# Altium schematic sheet power.SchDoc: Power
size A3; SheetNumber: 3
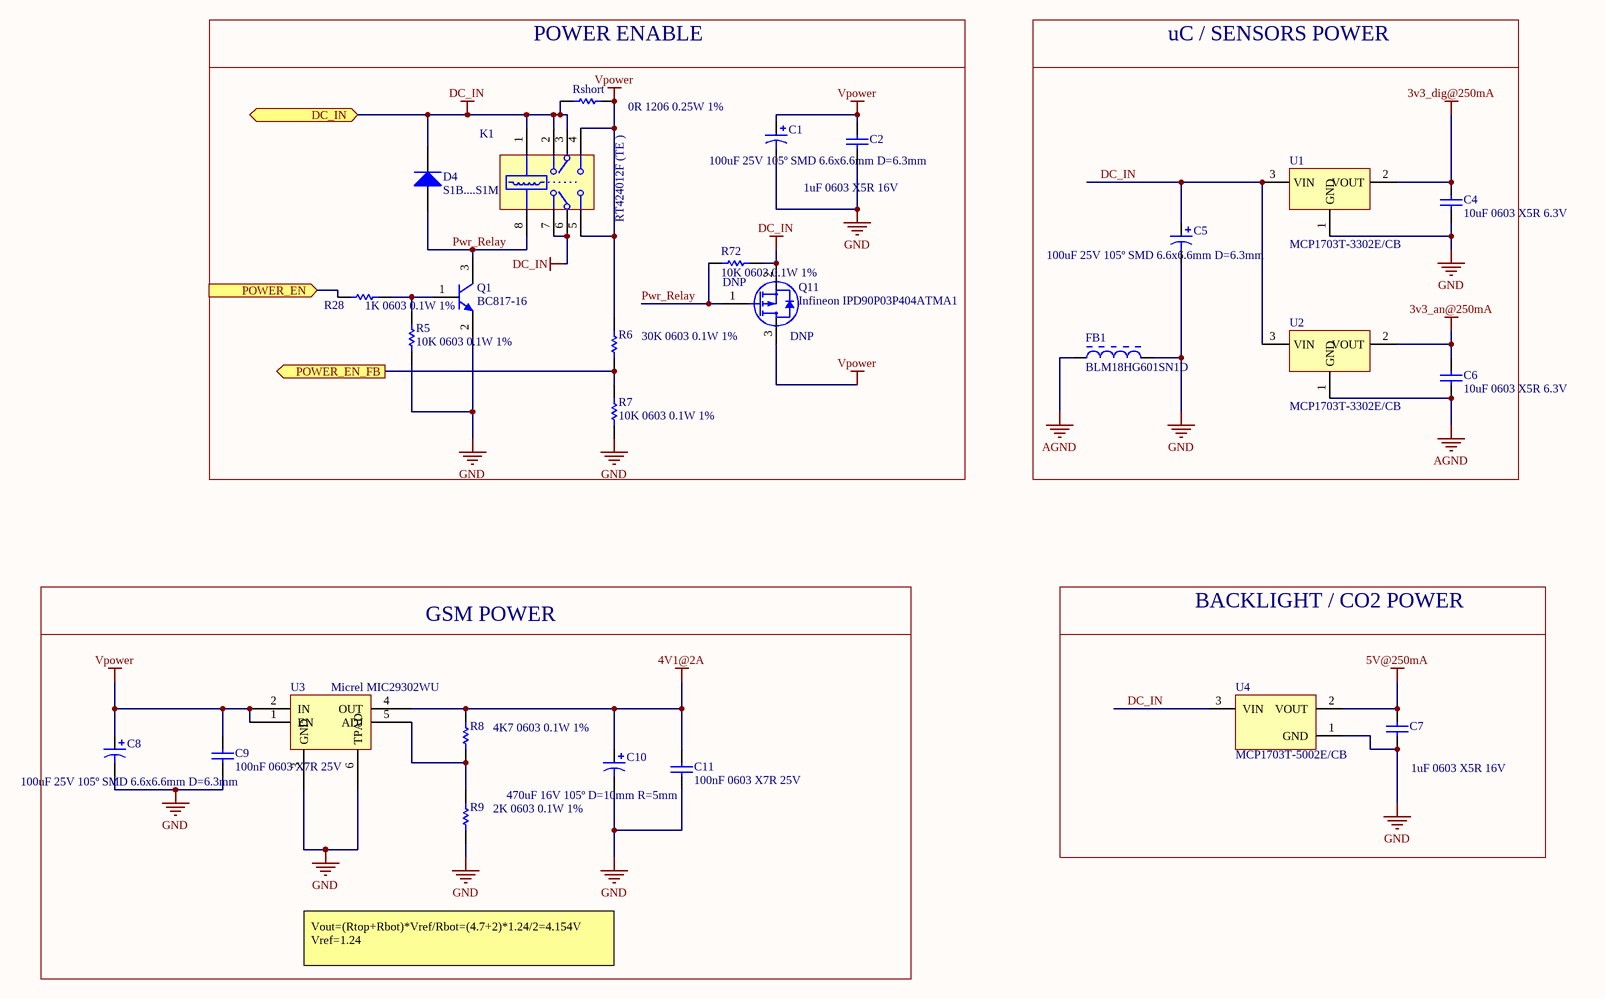
[diagram p0: power.SchDoc]

## Parts
C1  100uF 25V 105º SMD 6.6x6.6mm D=6.3mm  [PCB-5eg0a5nygcrzw5ibm1j9-1]
C2  1uF 0603 X5R 16V  [CAPC1608X60X35NL10T15]
C4  10uF 0603 X5R 6.3V  [CAPC1608X60X35NL10T15]
C5  100uF 25V 105º SMD 6.6x6.6mm D=6.3mm  [PCB-5eg0a5nygcrzw5ibm1j9-1]
C6  10uF 0603 X5R 6.3V  [CAPC1608X60X35NL10T15]
C7  1uF 0603 X5R 16V  [CAPC1608X60X35NL10T15]
C8  100uF 25V 105º SMD 6.6x6.6mm D=6.3mm  [PCB-5eg0a5nygcrzw5ibm1j9-1]
C9  100nF 0603 X7R 25V  [CAPC1608X60X35NL10T15]
C10  470uF 16V 105º D=10mm R=5mm  [PCBComponent_1 - duplicate]
C11  100nF 0603 X7R 25V  [CAPC1608X60X35NL10T15]
D4  S1B....S1M (DO-214)  [PCB-niliznqw36k7etm1u9na-1]
FB1  BLM18HG601SN1D  [MURA-BLM18-F-H1-CHIP-2_V]
K1  Manufacturer Part Number: RT424012F (TE )  [PCB-gjrzw9dtiyu3qrueb5gw-1]  (hidden comment: SYM-d1a918a3c97c0e6e-1)
Q1  BC817-16  [PCB-856332-1]
Q11  Infineon IPD90P03P404ATMA1  [DPAK IPD90P03P404ATMA1]  (no BOM)
R5  10K 0603 0.1W 1%  [RESC1609X55X30ML10T20]
R6  30K 0603 0.1W 1%  [RESC1609X55X30ML10T20]
R7  10K 0603 0.1W 1%  [RESC1609X55X30ML10T20]
R8  4K7 0603 0.1W 1%  [RESC1609X55X30ML10T20]
R9  2K 0603 0.1W 1%  [RESC1609X55X30ML10T20]
R28  1K 0603 0.1W 1%  [RESC1609X55X30ML10T20]
R72  10K 0603 0.1W 1%  [RESC1609X55X30ML10T20]
Rshort  0R 1206 0.25W 1%  [PCB-sxvxwfnl72ysl1kmtzgv-1]  (no BOM)
U1  MCP1703T-3302E/CB  [SOT-23A-CB3_L]
U2  MCP1703T-3302E/CB  [SOT-23A-CB3_L]
U3  Micrel MIC29302WU  [TI-KTT5_N]
U4  MCP1703T-5002E/CB  [SOT-23A-CB3_L]

## Blocks framed on the sheet
POWER ENABLE: C1 C2 D4 K1 Q1 Q11 R5-R7 R28 R72 Rshort
uC / SENSORS POWER: C4-C6 FB1 U1 U2
BACKLIGHT / CO2 POWER: C7 U4
GSM POWER: C8-C11 R8 R9 U3

## Ports
DC_IN, POWER_EN (in), POWER_EN_FB (out)

## Nets
3v3_an@250mA: C6.2 U2.2(VOUT)
3v3_dig@250mA: C4.2 U1.2(VOUT)
4V1@2A: C10.1 C11.2 R8.2 U3.4(OUT)
5V@250mA: C7.1 U4.2(VOUT)
AGND: C6.1 FB1.1 U2.1(GND)
DC_IN: C5.1 D4.2(K) K1.1 K1.2 K1.3 K1.6 K1.7 Q11.2(S) R72.2 Rshort.1 U1.3(VIN) U2.3(VIN) U4.3(VIN) ; port DC_IN
GND: C1.2 C2.2 C4.1 C5.2 C7.2 C8.2 C9.1 C10.2 C11.1 FB1.2 Q1.2(E) R5.2 R7.2 R9.1 U1.1(GND) U3.3(GND) U3.6(TPAD) U4.1(GND)
Vpower: C1.1 C2.1 C8.1 C9.2 K1.4 K1.5 Q11.3(D) R6.2 Rshort.2 U3.1(EN) U3.2(IN)
POWER_EN: R28.1 ; port POWER_EN
POWER_EN_FB: R6.1 R7.1 ; port POWER_EN_FB
Pwr_Relay: D4.1(A) K1.8 Q1.3(C) Q11.1(G) R72.1
NetQ1_1: Q1.1(B) R5.1 R28.2
NetR8_1: R8.1 R9.2 U3.5(ADJ)

## Notes on the sheet
- Vout=(Rtop+Rbot)*Vref/Rbot=(4.7+2)*1.24/2=4.154V
  Vref=1.24
- Title
- Size:
- Date:
- A3
- Author:
- Time:
- Revision:
- Sheet
- of
- File:

## Library data of the parts
C1 C5 C8 = CMP-a6d16ad512617916-1: Manufacturer Part Number: VZL101M1ETR-0607; Tolerance: 20%; Octopart URL: https://octopart.com/vzl101m1etr-0607-lelon-84840918; OctopartID: a6d16ad512617916; Capacity: 100uF; Voltage rating: 25V
C2 C7 = CMP-119984-2: Manufacturer Part Number: GRM185R61C105KE44D; Capacitance Tolerance: ±10%; Case/Package (in): 0603; Lead-Free Status: Lead Free; Capacitance: 1uF; Dielectric Characteristic: X5R; Lifecycle Status: Active; Mounting Style: Surface Mount; Number of Pins: 2; Octopart Url: https://octopart.com/grm185r61c105ke44d-murata-197446; OctopartID: de3e1737f81e01f9; REACH SVHC Compliance: No SVHC; RoHS: Compliant; Size-Height: 0.0005 m; Size-Length: 0.0016 m; Size-Thickness: 0.0005 m; Size-Width: 0.0008 m; Rated voltage: 16V
C4 C6 = CMP-121364-8: Rated voltage: 6v3; Dielectric carachteristic: X5R; Capacitance: 10uF; package: 0603
C9 C11 = CMP-c41a0d2b65641bdd-3: package: 0603; capacitance: 100 nF; Dielectric Characteristic: X7R; Rated voltage: 25V
C10 = CMP-ebd022d405293417-3: Manufacturer Part Number: 477CKH016M; Dielectric Material: Aluminum Electrolytic; Equivalent Series Resistance (ESR): 600 m?; Voltage Rating (DC): 16.0 V; Capacitance Tolerance: ±20%; Capacitance: 470 µF; Lead-Free Status: Lead Free; Size-Height: 12.5 mm; Mounting Style: Through Hole; OctopartID: ebd022d405293417; Octopart URL: https://octopart.com/477ckh016m-illinois+capacitor-969631; Size-Diameter: 10.0 mm; RoHS: Compliant; Packaging: Bulk
D4 = CMP-50d799d860158f10-1: Manufacturer Part Number: S1BB-13-F; Output Current: 1.00 A (max); Lead-Free Status: Exempt; Current Rating: 1.00 A; Polarity: Standard; Capacitance: 10.0 pF; Case/Package: DO-214; Lifecycle Status: Not Listed by Manufacturer; Octopart URL: https://octopart.com/s1bb-13-f-diodes+inc.-333220; RoHS: Compliant; Mounting Style: Surface Mount; OctopartID: 50d799d860158f10; Packaging: Cut Tape (CT), Tape & Reel (TR)
FB1 = CMP-19299602-3: Current Rating: 0.2 A; Frequency: 100000000.0 Hz; Lead-Free Status: Lead Free; Number of Circuits: 1; Resistance: 600.0 Ω; Shielding: No; Value: 600ohm 200mA; Manufacturer Part Number: BLM18HG601SN1D; Case/Package: 0603; Mounting Style: Surface Mount; Number of Pins: 2; Octopart Url: https://octopart.com/blm18hg601sn1d-murata-368340; OctopartID: c121082e7a931ee6; REACH SVHC Compliance: No SVHC; RoHS: Compliant; Size-Height: 0.0008 m; Size-Length: 0.0016 m; Size-Width: 0.0008 m
K1 = CMP-48a583f3a11c9762-9: Relay; E-Mech; Gen Purp; DPDT; Cur-Rtg 8A; Ctrl-V 12DC; Vol-Rtg 277/30AC/DC; PCB Mnt; ELV Compliant: Compliant; Voltage Rating (DC): 12.0 V; Coil Voltage: 12.0 V, 12.0 V (max); Coil Current: 33.3 mA; Current Rating: 8.00 A; Dropout Voltage: 1.20 V; Coil Resistance: 360 Ω; Lead-Free Status: Lead Free; Coil Power (DC): 400 mW; Mounting Style: PCB; REACH SVHC Compliance: No SVHC; Size-Length: 29.0 mm; Lifecycle Status: Active; Carry Current: 8.00 A; Contact Current Rating: 8.00 A; Size-Width: 12.7 mm; Octopart URL: http://octopart.com/rt424012f-te+connectivity-39636191; Contacts Type: DPDT; Input Voltage (DC): 12.0 V; Case/Package: DIP; RoHS: Compliant; OctopartID: 48a583f3a11c9762; Packaging: Box, Tube; Size-Height: 15.7 mm
Q1 = CMP-856332-3: TRANS NPN 45V 500mA SMD SOT23-3; Current Rating: 0.6 A; Lead-Free Status: Lead Free; Power Dissipation: 0.3 W; Voltage Rating (DC): 40.0 V; Case/Package: SOT-23; Lifecycle Status: Active; Mounting Style: Surface Mount; Number of Pins: 3; Octopart Url: https://octopart.com/mmbt2222a-7-f-diodes+inc.-357838; OctopartID: 53a79aa8030f8c60; Packaging: Cut Tape (CT); Polarity: NPN; REACH SVHC Compliance: No SVHC; RoHS: Compliant
Q11 = CMP-3103264-4: Single P-Channel 30 V 4.5 mOhm 100 nC OptiMOS Power Mosfet - TO-252-3-11; Lead-Free Status: Lead Free; Packaging: Reel; Operating Temperature: 175 °C (max); RoHS: Compliant; Polarity: P-Channel; Octopart URL: https://octopart.com/ipd90p03p404atma1-infineon-21386769; Mounting Style: Surface Mount; Manufacturer Part Number: IPD90P03P404ATMA1; OctopartID: f6ad3ee185da296a; Number of Pins: 3; REACH SVHC Compliance: No SVHC; DNP: DNP
R5 R7 R72 = CMP-4716590-9: Octopart Url: https://octopart.com/crcw060310k0fkeahp-vishay-42634028; package: 0603; Resistance: 10k; Tolerance: 1%
  R72: DNP: DNP
R6 R8 R9 = CMP-3655986-6: Tolerance: 1%; package: 0603
  R6: Resistance: 30k
  R8: Resistance: 4K7
  R9: Resistance: 2K
R28 = CMP-a61f6f36030f79d8-4: Manufacturer Part Number: CR0603-FX-1001ELF; Power Rating: 100 mW; Case/Package (SI): 1608; Voltage Rating (DC): 50.0 V; Temperature Coefficient: -100 ppm/°C to 100 ppm/°C; REACH SVHC Compliance: No SVHC; Packaging: Tape & Reel (TR), Cut Tape (CT); Resistance Tolerance: ±1%; Resistance: 1k; RoHS: Compliant; Mounting Style: Surface Mount; Number of Pins: 2; Size-Length: 1.60 mm; Octopart URL: https://octopart.com/cr0603-fx-1001elf-bourns-2326646; Size-Thickness: 457 µm; OctopartID: a61f6f36030f79d8; Size-Width: 787 µm; Case/Package: 0603
Rshort = CMP-3f1bf473a47ce0dc-5: Manufacturer Part Number: RC1206JR-070RL; Lead-Free Status: Lead Free; Resistance Tolerance: ±5%; Voltage Rating (DC): 200 V; Power Rating: 250 mW; Case/Package (SI): 3216; Resistance: 0R; Packaging: Cut Tape (CT), Tape & Reel (TR); Size-Width: 1.60 mm; Case/Package: 1206; Mounting Style: Surface Mount; Size-Length: 3.10 mm; OctopartID: 3f1bf473a47ce0dc; Number of Pins: 2; RoHS: Compliant
U1 U2 = CMP-1493313-4: Lead-Free Status: Lead Free; Number of Outputs: 1; Output Capacitor Type: Ceramic; Quiescent Current: 2e-06 A; Dropout Voltage: 0.65 V; RoHS: Compliant; Mounting Style: Surface Mount; OctopartID: 3caef5ca6a72e369; Packaging: Cut Tape (CT); Octopart Url: https://octopart.com/mcp1703t-3302e%2Fcb-microchip-7238586; Lifecycle Status: Active; Number of Pins: 3; REACH SVHC Compliance: No SVHC; Manufacturer Part Number: MCP1703T-3302E/CB
U3 = CMP-703eb93c7bacaff9-6: MIC29302 Series 3 A 1.24 to 26 V ADJ Output Voltage LDO Regulator - TO-263-5
U4 = CMP-1493315-2: 250 mA, 16V, Low Quiescent Current LDO Regulator, 3-Pin SOT-23A, Extended Temperature, Tape and Reel; Dropout Voltage: 0.65 V; Lead-Free Status: Lead Free; Number of Outputs: 1; Output Capacitor Type: Ceramic; Quiescent Current: 2e-06 A; Lifecycle Status: Active; Mounting Style: Surface Mount; Number of Pins: 3; Octopart Url: https://octopart.com/mcp1703t-5002e%2Fcb-microchip-7503776; OctopartID: fa42333aa0842585; Packaging: Cut Tape (CT); REACH SVHC Compliance: No SVHC; RoHS: Compliant; Manufacturer Part Number: MCP1703T-5002E/CB